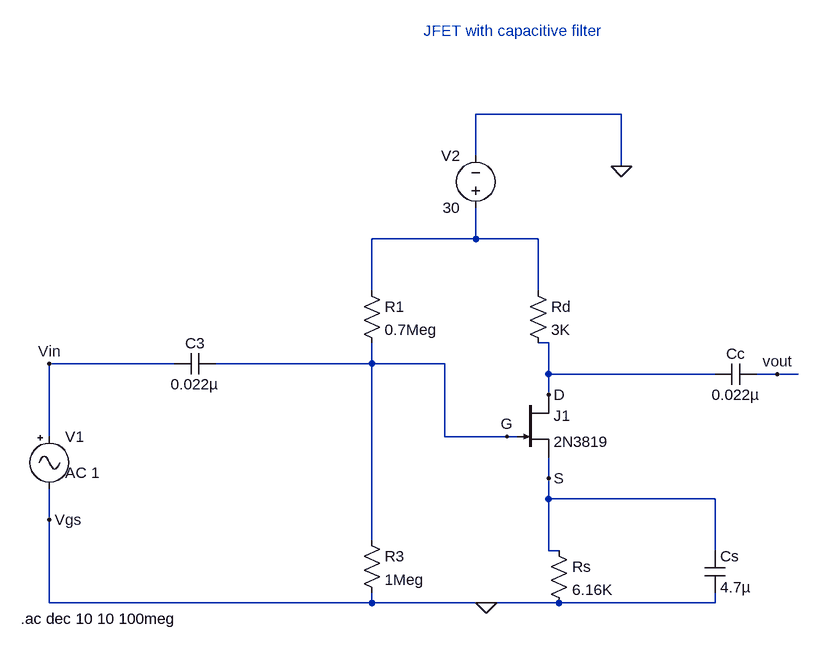
[diagram p0: schematic fet with capacitive filter.asc]
fet with capacitive filter.asc, the LTspice schematic file:
Version 4
SHEET 1 1212 680
WIRE 928 -352 704 -352
WIRE 704 -288 704 -352
WIRE 928 -272 928 -352
WIRE 704 -160 704 -208
WIRE 704 -160 544 -160
WIRE 800 -160 704 -160
WIRE 544 -80 544 -160
WIRE 800 -80 800 -160
WIRE 816 0 800 0
WIRE 240 32 48 32
WIRE 544 32 544 0
WIRE 544 32 304 32
WIRE 656 32 544 32
WIRE 816 48 816 0
WIRE 1072 48 816 48
WIRE 1168 48 1136 48
WIRE 1200 48 1168 48
WIRE 816 80 816 48
WIRE 48 144 48 32
WIRE 656 144 656 32
WIRE 752 144 656 144
WIRE 768 144 752 144
WIRE 816 208 816 176
WIRE 816 240 816 208
WIRE 1072 240 816 240
WIRE 48 272 48 224
WIRE 544 304 544 32
WIRE 816 320 816 240
WIRE 832 320 816 320
WIRE 1072 320 1072 240
WIRE 48 400 48 272
WIRE 544 400 544 384
WIRE 544 400 48 400
WIRE 720 400 544 400
WIRE 832 400 720 400
WIRE 1072 400 1072 384
WIRE 1072 400 832 400
FLAG 928 -272 0
FLAG 720 400 0
FLAG 752 144 G
FLAG 816 80 D
FLAG 816 208 S
FLAG 1168 48 vout
FLAG 48 32 Vin
FLAG 48 272 Vgs
SYMBOL Misc\\signal 48 128 R0
WINDOW 3 24 72 Left 2
WINDOW 123 24 44 Left 2
WINDOW 39 0 0 Left 0
SYMATTR InstName V1
SYMATTR Value AC 1
SYMBOL res 528 -96 R0
SYMATTR InstName R1
SYMATTR Value 0.7Meg
SYMBOL res 784 -96 R0
SYMATTR InstName Rd
SYMATTR Value 3K
SYMBOL res 528 288 R0
SYMATTR InstName R3
SYMATTR Value 1Meg
SYMBOL res 816 304 R0
SYMATTR InstName Rs
SYMATTR Value 6.16K
SYMBOL cap 304 16 R90
WINDOW 0 0 32 VBottom 2
WINDOW 3 32 32 VTop 2
SYMATTR InstName C3
SYMATTR Value 0.022µ
SYMATTR SpiceLine V=16 Irms=0 Rser=0.007 Lser=0
SYMBOL cap 1056 320 R0
SYMATTR InstName Cs
SYMATTR Value 4.7µ
SYMATTR SpiceLine V=6.3 Irms=0 Rser=0.001 Lser=0 mfg="TDK" pn="C3216X5ROJ106M" type="X5R"
SYMBOL njf 768 80 R0
SYMATTR InstName J1
SYMATTR Value 2N3819
SYMBOL voltage 704 -192 R180
WINDOW 0 24 96 Left 2
WINDOW 3 24 16 Left 2
WINDOW 123 0 0 Left 0
WINDOW 39 0 0 Left 0
SYMATTR InstName V2
SYMATTR Value 30
SYMBOL cap 1136 32 R90
WINDOW 0 0 32 VBottom 2
WINDOW 3 32 32 VTop 2
SYMATTR InstName Cc
SYMATTR Value 0.022µ
SYMATTR SpiceLine V=6.3 Irms=0 Rser=0.001 Lser=0 mfg="TDK" pn="C3216X5ROJ106M" type="X5R"
TEXT 4 424 Left 2 !.ac dec 10 10 100meg
TEXT 624 -480 Left 2 ;JFET with capacitive filter

The netlist it stands for:
* fet with capacitive filter.asc
V1 Vin 0 AC 1
R1 N001 G 0.7Meg
Rd N001 D 3K
R3 G 0 1Meg
Rs S 0 6.16K
C3 G Vin 0.022µ V=16 Irms=0 Rser=0.007 Lser=0
Cs S 0 4.7µ V=6.3 Irms=0 Rser=0.001 Lser=0 mfg="TDK" pn="C3216X5ROJ106M" type="X5R"
J1 D G S 2N3819
V2 N001 0 30
Cc vout D 0.022µ V=6.3 Irms=0 Rser=0.001 Lser=0 mfg="TDK" pn="C3216X5ROJ106M" type="X5R"
.model NJF NJF
.model PJF PJF
.lib standard.jft
.ac dec 10 10 100meg
* JFET with capacitive filter
.backanno
.end